# EAGLE design Rangkaian minimumSystem (EAGLE 9.6.2)
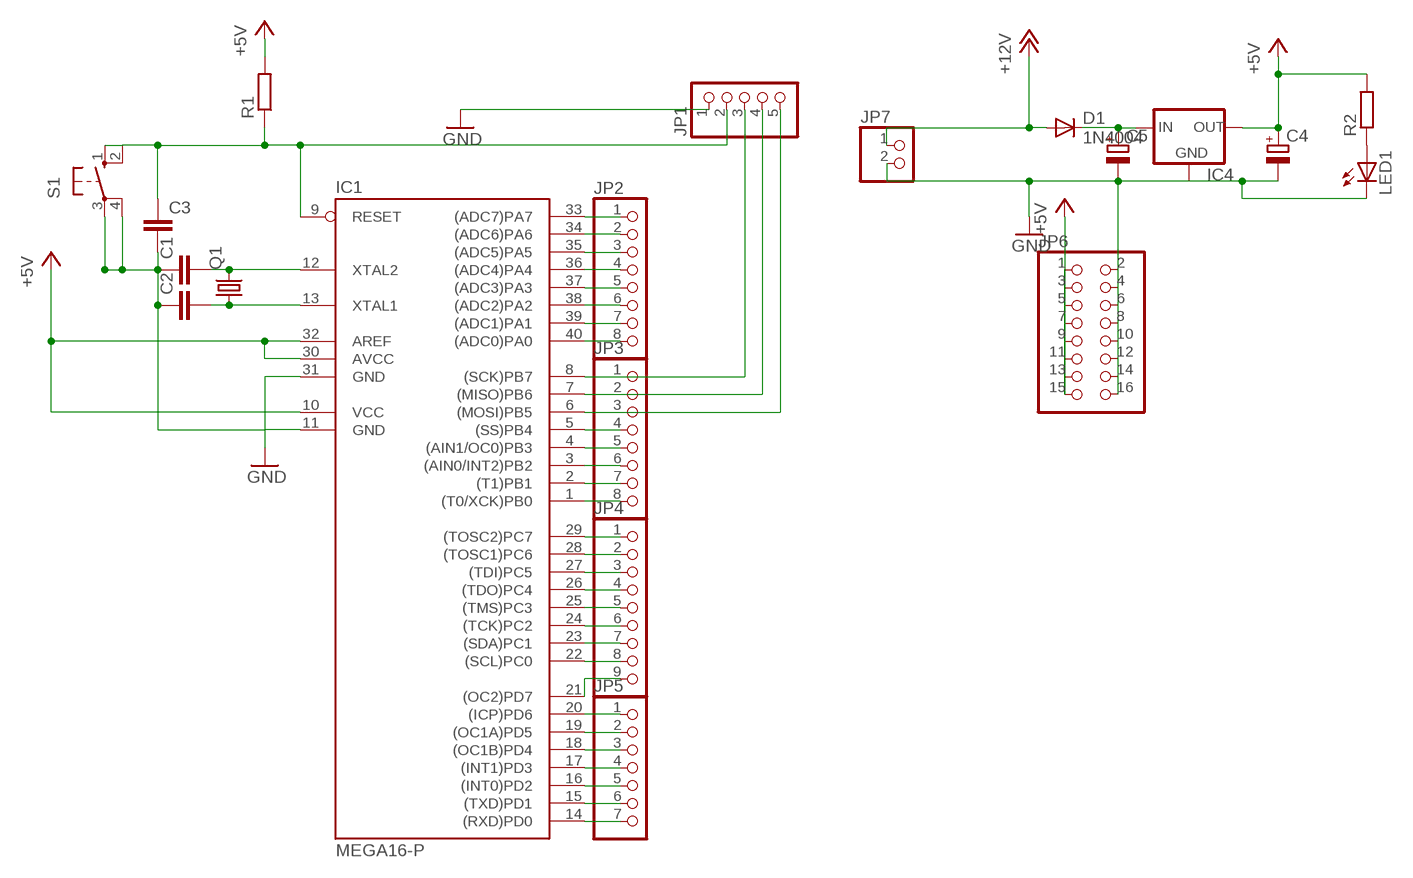
[diagram p0: schematic, sheet 1]

## Parts
C1  C-EU025-024X044  [C025-024X044]
C2  C-EU025-024X044  [C025-024X044]
C3  C-EU050-025X075  [C050-025X075]
C4  CPOL-EUE2.5-5  [E2,5-5]
C5  CPOL-EUE2.5-5  [E2,5-5]
D1  1N4004  [DO41-10]
IC1  MEGA16-P  [DIL40]
IC4  78XXS  [78XXS]
JP1  PINHD-1X5  [1X05]
JP2  PINHD-1X8  [1X08]
JP3  PINHD-1X8  [1X08]
JP4  PINHD-1X9  [1X09]
JP5  PINHD-1X7  [1X07]
JP6  PINHD-2X8  [2X08]
JP7  PINHD-1X2  [1X02]
LED1  LED5MM  [LED5MM]
Q1  CRYSTALHC49U-V  [HC49U-V]
R1  R-EU_0204/7  [0204/7]
R2  R-EU_0204/7  [0204/7]
S1  10-XX  [B3F-10XX]

## Nets
+5V: C4.+ IC1.10(VCC) IC1.30(AVCC) IC1.32(AREF) IC4.OUT JP6.1 JP6.3 JP6.5 JP6.7 JP6.9 JP6.11 JP6.13 JP6.15 R1.2 R2.2
+12V: D1.A JP7.1
C0: IC1.22((SCL)PC0) JP4.8
C1: IC1.23((SDA)PC1) JP4.7
C2: IC1.24((TCK)PC2) JP4.6
C3: IC1.25((TMS)PC3) JP4.5
D7: IC1.14((RXD)PD0) JP5.7
GND: C1.1 C2.1 C3.2 C4.- C5.- IC1.11(GND) IC1.31(GND) IC4.GND JP1.1 JP6.2 JP6.4 JP6.6 JP6.8 JP6.10 JP6.12 JP6.14 JP6.16 JP7.2 LED1.K(C) S1.3(P) S1.4(P1)
N$1: IC1.33((ADC7)PA7) JP2.1
N$2: IC1.34((ADC6)PA6) JP2.2
N$3: IC1.35((ADC5)PA5) JP2.3
N$4: IC1.36((ADC4)PA4) JP2.4
N$5: IC1.37((ADC3)PA3) JP2.5
N$6: IC1.38((ADC2)PA2) JP2.6
N$7: IC1.39((ADC1)PA1) JP2.7
N$8: IC1.40((ADC0)PA0) JP2.8
N$11: IC1.29((TOSC2)PC7) JP4.1
N$12: IC1.28((TOSC1)PC6) JP4.2
N$13: IC1.27((TDI)PC5) JP4.3
N$14: IC1.5((SS)PB4) JP3.4
N$15: IC1.20((ICP)PD6) JP5.1
N$16: IC1.19((OC1A)PD5) JP5.2
N$19: IC1.26((TDO)PC4) JP4.4
N$20: IC1.6((MOSI)PB5) JP1.5 JP3.3
N$21: IC1.4((AIN1/OC0)PB3) JP3.5
N$22: IC1.3((AIN0/INT2)PB2) JP3.6
N$23: IC1.2((T1)PB1) JP3.7
N$24: IC1.1((T0/XCK)PB0) JP3.8
N$25: C5.+ D1.C IC4.IN
N$30: IC1.15((TXD)PD1) JP5.6
N$31: IC1.16((INT0)PD2) JP5.5
N$32: IC1.17((INT1)PD3) JP5.4
N$33: C3.1 IC1.9(RESET) JP1.2 R1.1 S1.1(S) S1.2(S1)
N$34: IC1.18((OC1B)PD4) JP5.3
N$35: C1.2 IC1.12(XTAL2) Q1.2
N$36: C2.2 IC1.13(XTAL1) Q1.1
N$37: LED1.A R2.1
N$46: IC1.8((SCK)PB7) JP1.3 JP3.1
N$47: IC1.7((MISO)PB6) JP1.4 JP3.2
RS: IC1.21((OC2)PD7) JP4.9

## Library data of the parts
C1 C2 = rcl:C-EU: CAPACITOR, European symbol
C3 = resistor:C-EU: CAPACITOR, European symbol
C4 C5 = rcl:CPOL-EU: POLARIZED CAPACITOR, European symbol
D1 = diode:1N4004: DIODE general purpose rectifier, 1 A
IC1 = atmel:MEGA16-P: MICROCONTROLLER 16 Kbytes FLASH 1 kbytes SRAM 512 bytes EEPROM USART 8-channel 10 bit ADC Source: avr.lbr; MPN: ATMEGA16-16PU; OC_FARNELL: 9171142; OC_NEWARK: 01M6885
IC4 = v-reg:78XXS: VOLTAGE REGULATOR
JP1 = pinhead:PINHD-1X5: PIN HEADER
JP2 JP3 = pinhead:PINHD-1X8: PIN HEADER
JP4 = pinhead:PINHD-1X9: PIN HEADER
JP5 = pinhead:PINHD-1X7: PIN HEADER
JP6 = pinhead:PINHD-2X8: PIN HEADER
JP7 = pinhead:PINHD-1X2: PIN HEADER
LED1 = led:LED: LED OSRAM: - CHIPLED LG R971, LG N971, LY N971, LG Q971, LY Q971, LO R971, LY R971 LH N974, LH R974 LS Q976, LO Q976, LY Q976 LO Q996 - Hyper CHIPLED LW Q18S LB Q993, LB Q99A, LB R99A - SideLED LS A670, LO A670, LY A670, LG A670, LP A670 LB A673, LV A673, LT A673, LW A673 LH A674 LY A675 LS A676, LA A676, LO A676, LY A676, LW A676 LS A679, LY A679, LG A679 - Hyper Micro SIDELED® LS Y876, LA Y876, LO Y876, LY Y876 LT Y87S - SmartLED LW L88C, LW L88S LB L89C, LB L89S, LG L890 LS L89K, LO L89K, LY L89K LS L896, LA L896, LO L896, LY L896 - TOPLED LS T670, LO T670, LY T670, LG T670, LP T670 LSG T670, LSP T670, LSY T670, LOP T670, LYG T670 LG T671, LOG T671, LSG T671 LB T673, LV T673, LT T673, LW T673 LH T674 LS T676, LA T676, LO T676, LY T676, LB T676, LH T676, LSB T676, LW T676 LB T67C, LV T67C, LT T67C, LS T67K, LO T67K, LY T67K, LW E67C LS E67B, LA E67B, LO E67B, LY E67B, LB E67C, LV E67C, LT E67C LW T67C LS T679, LY T679, LG T679 LS T770, LO T770, LY T770, LG T770, LP T770 LB T773, LV T773, LT T773, LW T773 LH T774 LS E675, LA E675, LY E675, LS T675 LS T776, LA T776, LO T776, LY T776, LB T776 LHGB T686 LT T68C, LB T68C - Hyper Mini TOPLED® LB M676 - Mini TOPLED Santana® LG M470 LS M47K, LO M47K, LY M47K Source: http://www.osram.convergy.de LUXEON: - LUMILED® LXK2-PW12-R00, LXK2-PW12-S00, LXK2-PW14-U00, LXK2-PW14-V00 LXK2-PM12-R00, LXK2-PM12-S00, LXK2-PM14-U00 LXK2-PE12-Q00, LXK2-PE12-R00, LXK2-PE12-S00, LXK2-PE14-T00, LXK2-PE14-U00 LXK2-PB12-K00, LXK2-PB12-L00, LXK2-PB12-M00, LXK2-PB14-N00, LXK2-PB14-P00, LXK2-PB14-Q00 LXK2-PR12-L00, LXK2-PR12-M00, LXK2-PR14-Q00, LXK2-PR14-R00 LXK2-PD12-Q00, LXK2-PD12-R00, LXK2-PD12-S00 LXK2-PH12-R00, LXK2-PH12-S00 LXK2-PL12-P00, LXK2-PL12-Q00, LXK2-PL12-R00 Source: www.luxeon.com KINGBRIGHT: KA-3528ASYC Source: www.kingbright.com
Q1 = crystal:CRYSTAL: CRYSTAL; OC_FARNELL: 1666969; OC_NEWARK: unknown
R1 R2 = rcl:R-EU_: RESISTOR, European symbol
S1 = switch-omron:10-XX: OMRON SWITCH; MPN: B3F-1000; OC_FARNELL: 176432; OC_NEWARK: 36M3542

## Net classes
0 default: width 0.254 mm, drill 0.254 mm, clearance 0.254 mm

## Board
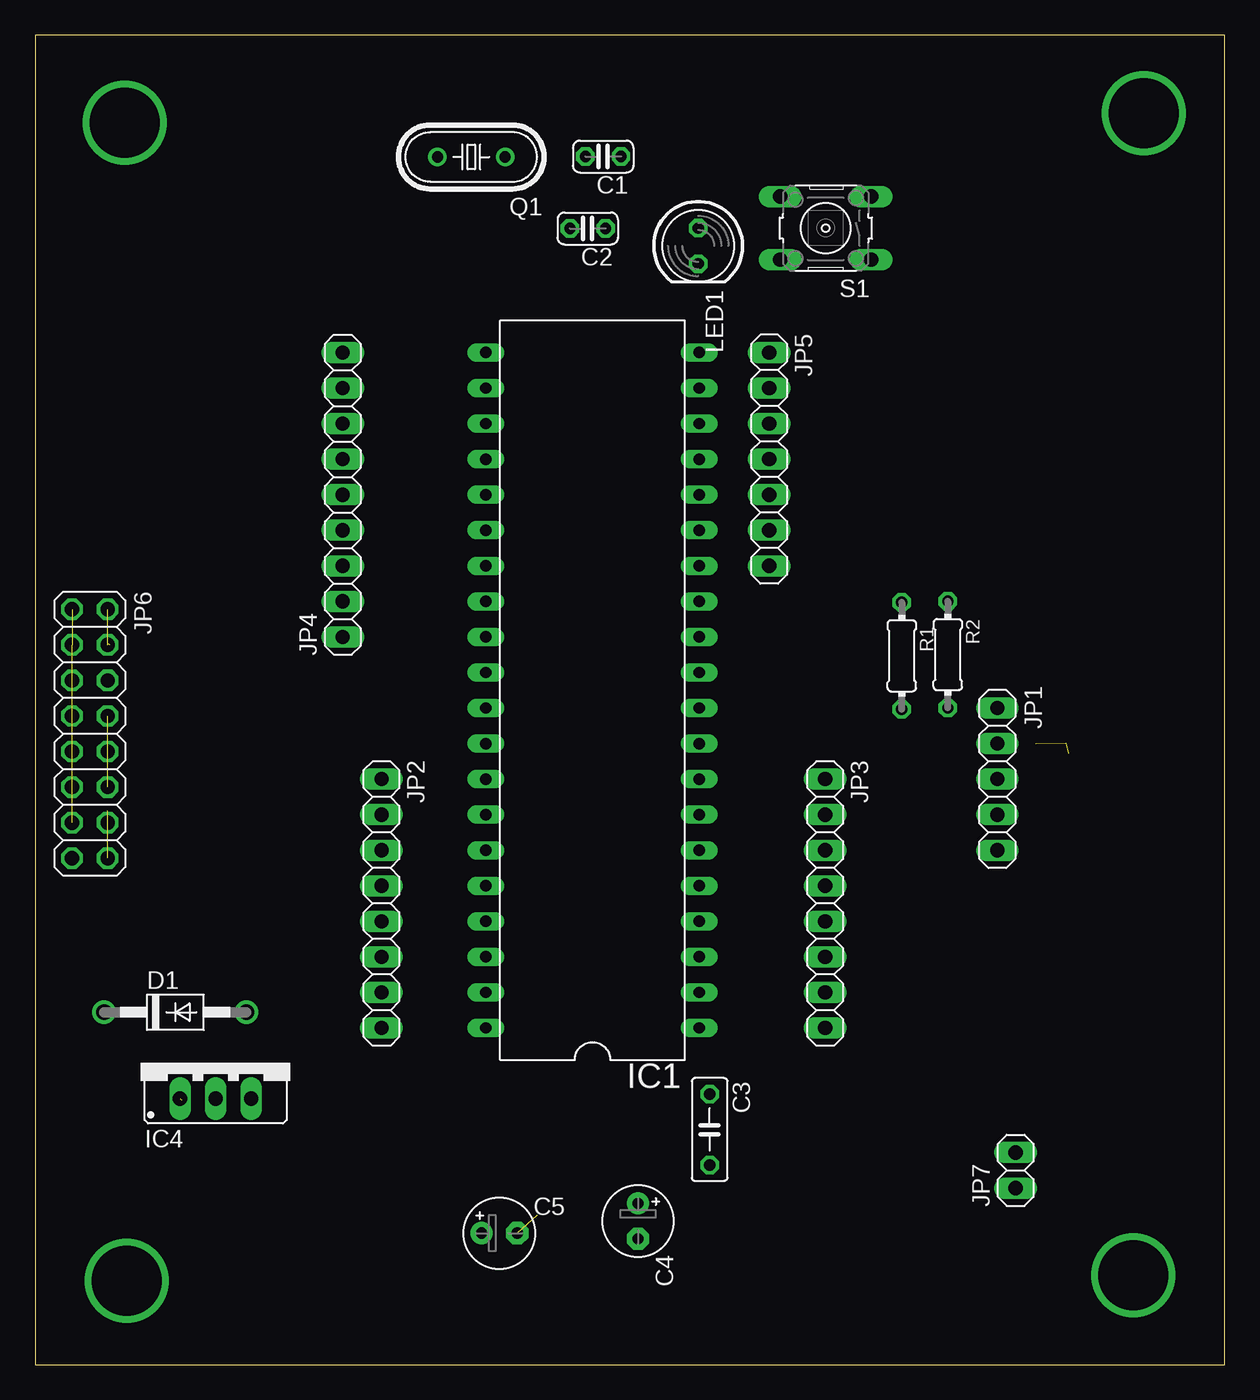
[diagram p1: board, top side]
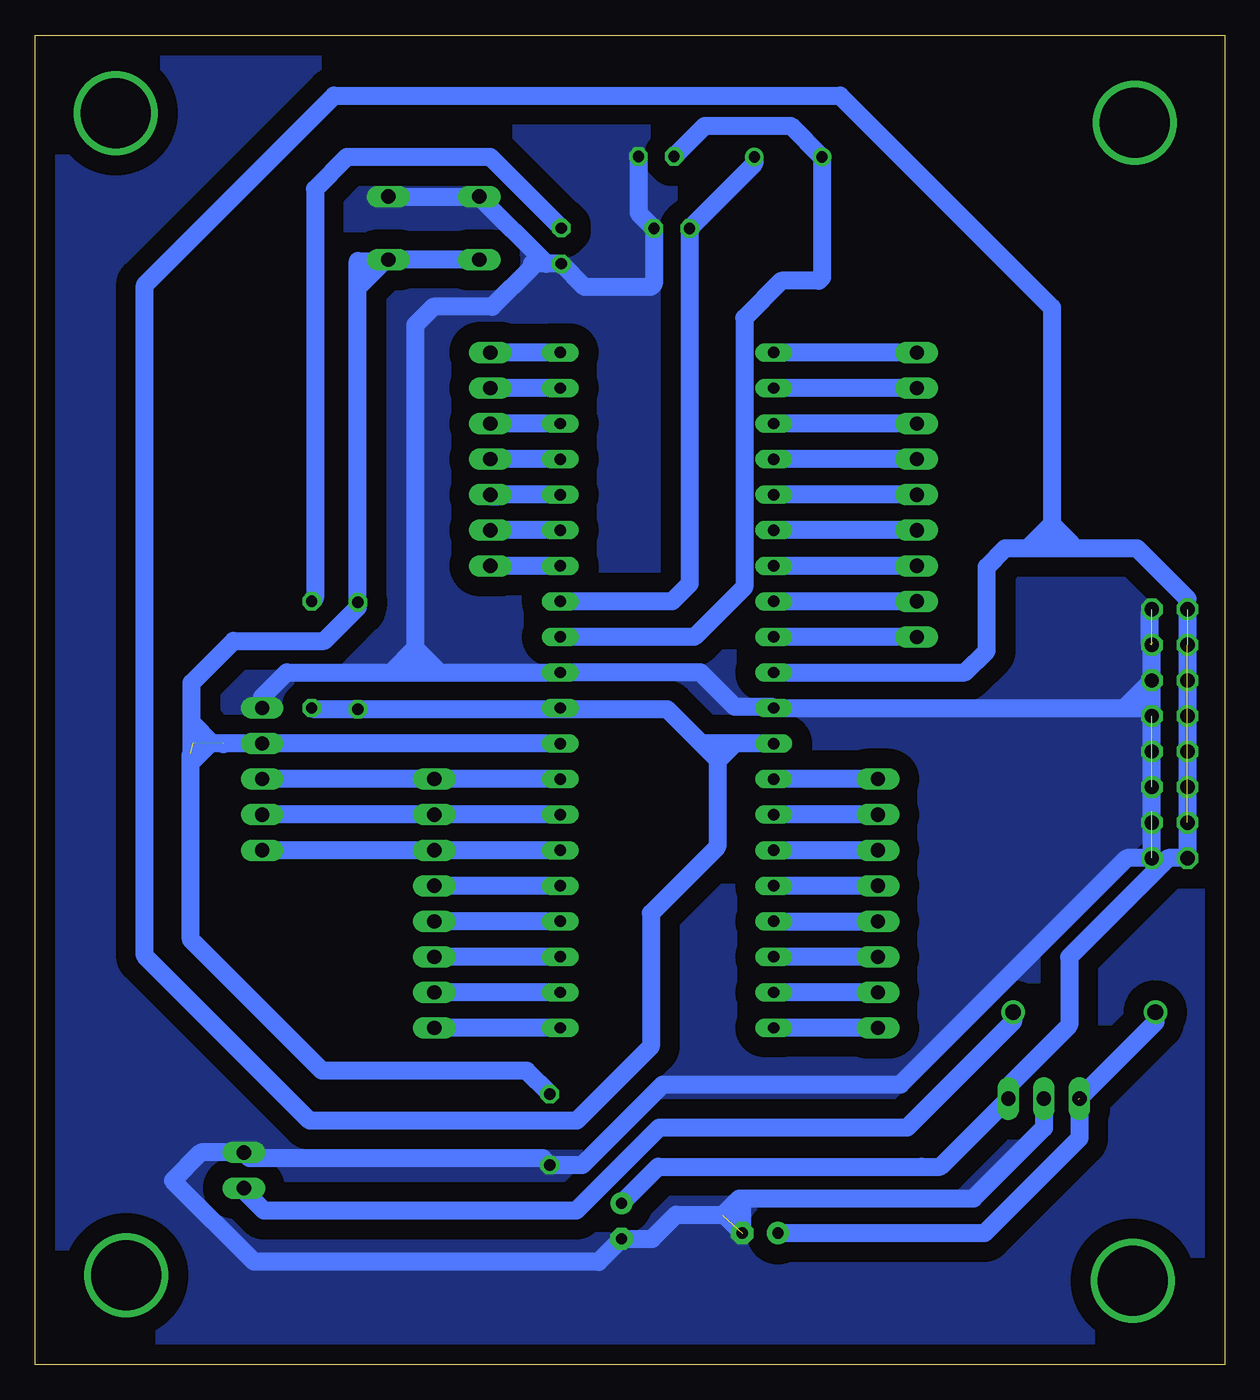
[diagram p2: board, bottom side, seen from below]

Size 85 x 95 mm. Coordinates in mm from the lower left corner, seen from the top.
Outline: 0,0 85,0 85,95 0,95 0,0
Copper layers (1*16): Top 0.035mm / dielectric 1.5mm / Bottom 0.035mm
Design rules "default": minimum track width 6mil, minimum drill 0.35mm, track to track 6mil, track to pad 6mil, pad to pad 6mil, via to via 6mil, smd to smd 6mil, copper to edge 40mil, drill to drill 6mil, minimum pad ring 10mil, minimum via ring 8mil, stop-mask expansion 4mil, vias tented up to drill 0mil, thermal gap 10mil

### Footprints (pad centres in the part's own frame; a part is rotated, then mirrored left to right if it is on the bottom)
C025-024X044 = drill 0.813 octagon: 1 -1.27,0; 2 1.27,0
C050-025X075 = drill 0.813 octagon: 1 -2.54,0; 2 2.54,0
E2,5-5 = drill 0.813 pad 1.6: + -1.27,0 | drill 0.813 pad 1.6 octagon: - 1.27,0
DO41-10 = drill 1.118: A 5.08,0; C -5.08,0
DIL40 = drill 0.813 long: 1 -24.13,-7.62; 2 -21.59,-7.62; 3 -19.05,-7.62; 4 -16.51,-7.62; 5 -13.97,-7.62; 6 -11.43,-7.62; 7 -8.89,-7.62; 8 -6.35,-7.62; 9 -3.81,-7.62; 10 -1.27,-7.62; 11 1.27,-7.62; 12 3.81,-7.62; 13 6.35,-7.62; 14 8.89,-7.62; 15 11.43,-7.62; 16 13.97,-7.62; 17 16.51,-7.62; 18 19.05,-7.62; 19 21.59,-7.62; 20 24.13,-7.62; 21 24.13,7.62; 22 21.59,7.62; 23 19.05,7.62; 24 16.51,7.62; 25 13.97,7.62; 26 11.43,7.62; 27 8.89,7.62; 28 6.35,7.62; 29 3.81,7.62; 30 1.27,7.62; 31 -1.27,7.62; 32 -3.81,7.62; 33 -6.35,7.62; 34 -8.89,7.62; 35 -11.43,7.62; 36 -13.97,7.62; 37 -16.51,7.62; 38 -19.05,7.62; 39 -21.59,7.62; 40 -24.13,7.62
78XXS = drill 1.016 long: GND 0,-2.54; IN -2.54,-2.54; OUT 2.54,-2.54
1X05 = drill 1.016 long: 1 -5.08,0; 2 -2.54,0; 3 0,0; 4 2.54,0; 5 5.08,0
1X08 = drill 1.016 long: 1 -8.89,0; 2 -6.35,0; 3 -3.81,0; 4 -1.27,0; 5 1.27,0; 6 3.81,0; 7 6.35,0; 8 8.89,0
1X09 = drill 1.016 long: 1 -10.16,0; 2 -7.62,0; 3 -5.08,0; 4 -2.54,0; 5 0,0; 6 2.54,0; 7 5.08,0; 8 7.62,0; 9 10.16,0
1X07 = drill 1.016 long: 1 -7.62,0; 2 -5.08,0; 3 -2.54,0; 4 0,0; 5 2.54,0; 6 5.08,0; 7 7.62,0
2X08 = drill 1.016 octagon: 1 -8.89,-1.27; 2 -8.89,1.27; 3 -6.35,-1.27; 4 -6.35,1.27; 5 -3.81,-1.27; 6 -3.81,1.27; 7 -1.27,-1.27; 8 -1.27,1.27; 9 1.27,-1.27; 10 1.27,1.27; 11 3.81,-1.27; 12 3.81,1.27; 13 6.35,-1.27; 14 6.35,1.27; 15 8.89,-1.27; 16 8.89,1.27
1X02 = drill 1.016 long: 1 -1.27,0; 2 1.27,0
LED5MM = drill 0.813 octagon: A -1.27,0; K 1.27,0
HC49U-V = drill 0.813: 1 -2.413,0; 2 2.413,0
0204/7 = drill 0.813 octagon: 1 -3.81,0; 2 3.81,0
B3F-10XX = drill 1.016 long: 1 -3.251,2.261; 2 3.251,2.261; 3 -3.251,-2.261; 4 3.251,-2.261

### Placement (x,y rotation side)
C1  40.61,86.31 180 top
C2  39.5,81.17 180 top
C3  48.21,16.79 270 top
C4  43.09,10.25 270 top
C5  33.18,9.38 0 top
D1  10.02,25.17 0 top
IC1  39.84,48.18 90 top
IC4  12.9,21.54 0 top
JP1  68.77,41.83 270 top
JP2  24.76,32.94 270 top
JP3  56.47,32.94 270 top
JP4  21.99,62.15 90 top
JP5  52.47,64.69 270 top
JP6  3.92,45.07 270 top
JP7  70.07,13.87 90 top
LED1  47.39,79.93 270 top
Q1  31.18,86.28 180 top
R1  61.94,50.64 270 top
R2  65.23,50.72 270 top
S1  56.5,81.2 180 top

### Tracks (layer width: path | path; a pad name or v marks a point on that pad's centre or on a via)
+5V  (6 unrouted)
  Bottom 1.27: IC1.32 35,44.37 | 37.37,44.37 39.83,46.84 47.38,46.84 IC1.10 47.52,46.85 61.92,46.85 | R1.2 61.92,46.85 | R2.2 65.16,46.85 61.92,46.85 | IC1.30 18.55,49.45 17,51 17,57 15.66,58.34 13.93,58.34 | 13.93,58.34 12.33,58.34 | 12.33,58.34 10.95,58.34 | 10.95,58.34 6.26,58.34 2.65,54.73 JP6.1 JP6.15 4.03,36.18 11.09,29.12 11.09,24.24 15.44,19.89 IC4.OUT 20.31,14.13 21.63,14.13 40.48,14.13 C4.+ | 36.23,43.16 36.23,37 40.99,32.24 40.99,22.71 46.29,17.41 65.37,17.41 77.15,29.2 77.15,77.14 63.63,90.66 27.47,90.66 12.33,75.52 12.33,60.04 | 12.33,58.34 12.33,60.04 | 12.33,60.04 10.95,58.67 10.95,58.34 | 12.33,60.04 13.93,58.44 13.93,58.34 | 35,44.37 36.21,43.16 36.23,43.16 | 37.37,44.37 36.23,43.23 36.23,43.16 | 35,44.37 37.37,44.37
+12V
  Bottom 1.27: D1.A 15.1,24.5 22.69,16.92 40.4,16.92 46.32,11 68.63,11 70.07,12.45 JP7.1
C0
  Bottom 1.27: JP4.8 IC1.22
C1
  Bottom 1.27: JP4.7 IC1.23
C2
  Bottom 1.27: JP4.6 IC1.24
C3
  Bottom 1.27: JP4.5 IC1.25
D7
  Bottom 1.27: IC1.14 JP5.7
GND  (7 unrouted)
  Bottom 1.27: C1.1 41.88,82.28 C2.1 40.77,77.23 41,77 45.73,77 LED1.K 48.45,78.66 | 48.45,78.66 49.5,78.66 49.5,78.41 52.33,75.58 56.53,75.58 57.83,74.28 57.83,51.19 | 48.45,78.66 S1.4 S1.3 | IC1.31 32.31,47 35,47 37.45,49.45 IC1.11 56.09,49.45 | 59.56,49.45 67,49.45 68.77,47.69 JP1.1 | 59.56,49.45 57.98,49.45 | 57.98,49.45 56.09,49.45 | 5.15,51.54 5.19,51.5 JP6.8 | 5.33,51.44 5.33,53.82 JP6.2 | JP6.8 5.19,46.66 5.43,46.91 IC1.31 | JP6.8 JP6.16 6.98,36.18 23.15,20 40.14,20 45.89,14.25 C3.2 48.72,14.76 69.69,14.76 JP7.2 73.14,15.14 75.15,13.14 69.35,7.34 44.73,7.34 C4.- 40.9,8.98 39.18,10.7 35.78,10.7 C5.- 34.45,11.87 17.94,11.87 12.9,16.9 IC4.GND | IC1.31 7.16,46.91 JP6.6 | 34.69,11.84 35.88,10.65 | 57.98,49.45 57.83,49.6 57.83,51.19 | 57.83,51.19 56.09,49.45 | 57.83,51.19 59.56,49.45
  pour Bottom (isolate 1.422, no thermals): 0,0 85,0 85,95 0,95
N$1
  Bottom 1.27: JP2.1 IC1.33
N$2
  Bottom 1.27: JP2.2 IC1.34
N$3
  Bottom 1.27: JP2.3 IC1.35
N$4
  Bottom 1.27: JP2.4 IC1.36
N$5
  Bottom 1.27: IC1.37 JP2.5
N$6
  Bottom 1.27: JP2.6 IC1.38
N$7
  Bottom 1.27: JP2.7 IC1.39
N$8
  Bottom 1.27: JP2.8 IC1.40
N$9  (via drill 5)
  other vias: 6.42,88.73
N$10  (via drill 5)
  other vias: 79.23,89.41
N$11
  Bottom 1.27: JP4.1 IC1.29
N$12
  Bottom 1.27: JP4.2 IC1.28
N$13
  Bottom 1.27: JP4.3 IC1.27
N$14
  Bottom 1.27: IC1.5 JP3.4
N$15
  Bottom 1.27: IC1.20 JP5.1
N$16
  Bottom 1.27: IC1.19 JP5.2
N$17  (via drill 5)
  other vias: 78.48,6.38
N$18  (via drill 5)
  other vias: 6.55,5.98
N$19
  Bottom 1.27: JP4.4 IC1.26
N$20
  Bottom 1.27: IC1.6 JP3.3 JP1.5
N$21
  Bottom 1.27: IC1.4 JP3.5
N$22
  Bottom 1.27: IC1.3 JP3.6
N$23
  Bottom 1.27: IC1.2 JP3.7
N$24
  Bottom 1.27: IC1.1 JP3.8
N$25  (via drill 0.35)  (1 unrouted)
  Bottom 1.27: 10.47,18.93 4.95,24.45 D1.C | C5.+ 17.15,9.38 10.36,16.16 IC4.IN
  other vias: 10.36,19
N$30
  Bottom 1.27: IC1.15 JP5.6
N$31
  Bottom 1.27: IC1.16 51.85,62.15 52,62 52.32,62 JP5.5
N$32
  Bottom 1.27: IC1.17 JP5.4
N$33  (2 unrouted)
  Bottom 1.27: IC1.9 JP1.2 | C3.1 49.87,21 64.5,21 73.86,30.36 73.86,43.65 | 71.5,44.37 71.55,44.32 71.6,44.37 JP1.2 | JP1.2 72.48,44.37 73.81,43.04 73.81,48.7 70.81,51.7 64.33,51.7 61.94,54.09 R1.1 61.94,78.85 59.75,78.85 S1.1 | 73.7,44.42 72.36,44.42 73.64,45.7 | S1.2 S1.1 | S1.1 59.95,78.94 61.81,77.08
N$34
  Bottom 1.27: IC1.18 JP5.3
N$35
  Bottom 1.27: C1.2 37.13,88.51 30.99,88.51 Q1.2 28.76,77.67 29,77.43 31.66,77.43 34.32,74.78 34.32,55.55 37.88,51.99 IC1.12
N$36
  Bottom 1.27: Q1.1 33.59,85.81 C2.2 38.23,55.77 39.47,54.53 IC1.13
N$37
  Bottom 1.27: LED1.A 52.46,86.27 62.73,86.27 65,84 65,54.76 R2.1
N$46
  Bottom 1.27: IC1.8 JP3.1 JP1.3
N$47
  Bottom 1.27: IC1.7 JP3.2 JP1.4
RS
  Bottom 1.27: JP4.9 IC1.21